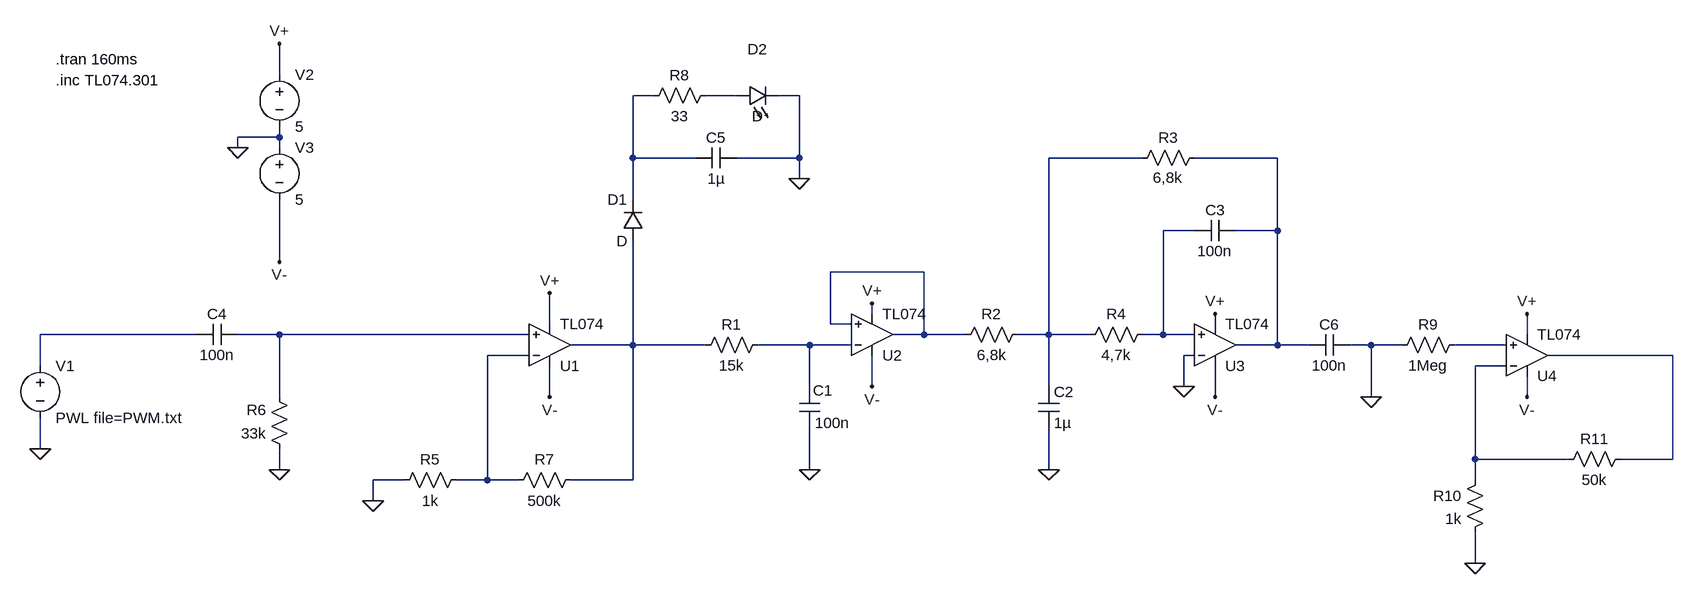
[diagram p0: schematic Empfangsseite_V2.asc]
Empfangsseite_V2.asc, the LTspice schematic file:
Version 4
SHEET 1 1944 680
WIRE -304 -336 -304 -384
WIRE 272 -304 240 -304
WIRE 400 -304 352 -304
WIRE 496 -304 464 -304
WIRE -304 -240 -304 -256
WIRE -304 -240 -368 -240
WIRE -368 -224 -368 -240
WIRE -304 -224 -304 -240
WIRE 240 -208 240 -304
WIRE 336 -208 240 -208
WIRE 496 -208 496 -304
WIRE 496 -208 400 -208
WIRE 1024 -208 880 -208
WIRE 1232 -208 1104 -208
WIRE 496 -176 496 -208
WIRE 240 -144 240 -208
WIRE 1104 -96 1056 -96
WIRE 1232 -96 1232 -208
WIRE 1232 -96 1168 -96
WIRE -304 -48 -304 -144
WIRE 688 -32 544 -32
WIRE 608 32 608 16
WIRE 112 48 112 0
WIRE 544 48 544 -32
WIRE 576 48 544 48
WIRE 1136 48 1136 32
WIRE -432 64 -672 64
WIRE -304 64 -368 64
WIRE 80 64 -304 64
WIRE 688 64 688 -32
WIRE 688 64 640 64
WIRE 752 64 688 64
WIRE 880 64 880 -208
WIRE 880 64 832 64
WIRE 944 64 880 64
WIRE 1056 64 1056 -96
WIRE 1056 64 1024 64
WIRE 1104 64 1056 64
WIRE 1616 64 1616 32
WIRE 240 80 240 -80
WIRE 240 80 144 80
WIRE 352 80 240 80
WIRE 512 80 432 80
WIRE 576 80 512 80
WIRE 1232 80 1232 -96
WIRE 1232 80 1168 80
WIRE 1280 80 1232 80
WIRE 1376 80 1344 80
WIRE 1424 80 1376 80
WIRE 1584 80 1504 80
WIRE 80 96 16 96
WIRE 1104 96 1088 96
WIRE 1840 96 1648 96
WIRE -672 112 -672 64
WIRE 1584 112 1536 112
WIRE 512 144 512 80
WIRE 608 144 608 96
WIRE 880 144 880 64
WIRE 1088 144 1088 96
WIRE -304 160 -304 64
WIRE 112 160 112 112
WIRE 1136 160 1136 112
WIRE 1376 160 1376 80
WIRE 1616 160 1616 128
WIRE -672 240 -672 192
WIRE 1536 256 1536 112
WIRE 1680 256 1536 256
WIRE 1840 256 1840 96
WIRE 1840 256 1760 256
WIRE -304 272 -304 240
WIRE 512 272 512 208
WIRE 880 272 880 208
WIRE -112 288 -160 288
WIRE 16 288 16 96
WIRE 16 288 -32 288
WIRE 64 288 16 288
WIRE 240 288 240 80
WIRE 240 288 144 288
WIRE 1536 288 1536 256
WIRE -160 320 -160 288
WIRE 1536 416 1536 368
FLAG 512 272 0
FLAG 880 272 0
FLAG 1088 144 0
FLAG -672 240 0
FLAG -304 -384 V+
FLAG 608 16 V+
FLAG 1136 32 V+
FLAG 1136 160 V-
FLAG 608 144 V-
FLAG -304 -48 V-
FLAG -368 -224 0
FLAG 112 0 V+
FLAG 112 160 V-
FLAG -304 272 0
FLAG -160 320 0
FLAG 496 -176 0
FLAG 1376 160 0
FLAG 1616 32 V+
FLAG 1616 160 V-
FLAG 1536 416 0
SYMBOL cap 496 144 R0
WINDOW 0 21 6 Left 2
SYMATTR InstName C1
SYMATTR Value 100n
SYMBOL cap 864 144 R0
SYMATTR InstName C2
SYMATTR Value 1µ
SYMBOL cap 1168 -112 R90
WINDOW 0 0 32 VBottom 2
WINDOW 3 32 32 VTop 2
SYMATTR InstName C3
SYMATTR Value 100n
SYMBOL res 448 64 R90
WINDOW 0 0 56 VBottom 2
WINDOW 3 32 56 VTop 2
SYMATTR InstName R1
SYMATTR Value 15k
SYMBOL res 848 48 R90
WINDOW 0 0 56 VBottom 2
WINDOW 3 32 56 VTop 2
SYMATTR InstName R2
SYMATTR Value 6,8k
SYMBOL res 1120 -224 R90
WINDOW 0 0 56 VBottom 2
WINDOW 3 31 57 VTop 2
SYMATTR InstName R3
SYMATTR Value 6,8k
SYMBOL res 1040 48 R90
WINDOW 0 0 56 VBottom 2
WINDOW 3 32 56 VTop 2
SYMATTR InstName R4
SYMATTR Value 4,7k
SYMBOL voltage -672 96 R0
WINDOW 123 24 124 Left 2
WINDOW 39 0 0 Left 2
SYMATTR InstName V1
SYMATTR Value PWL file=PWM.txt
SYMBOL voltage -304 -352 R0
WINDOW 123 0 0 Left 2
WINDOW 39 0 0 Left 2
SYMATTR InstName V2
SYMATTR Value 5
SYMBOL voltage -304 -240 R0
WINDOW 123 0 0 Left 2
WINDOW 39 0 0 Left 2
SYMATTR InstName V3
SYMATTR Value 5
SYMBOL res -288 256 R180
WINDOW 0 36 76 Left 2
WINDOW 3 36 40 Left 2
SYMATTR InstName R6
SYMATTR Value 33k
SYMBOL cap -368 48 R90
WINDOW 0 0 32 VBottom 2
WINDOW 3 32 32 VTop 2
SYMATTR InstName C4
SYMATTR Value 100n
SYMBOL res -16 272 R90
WINDOW 0 0 56 VBottom 2
WINDOW 3 32 56 VTop 2
SYMATTR InstName R5
SYMATTR Value 1k
SYMBOL res 160 272 R90
WINDOW 0 0 56 VBottom 2
WINDOW 3 32 56 VTop 2
SYMATTR InstName R7
SYMATTR Value 500k
SYMBOL diode 256 -80 R180
WINDOW 0 24 64 Left 2
WINDOW 3 24 0 Left 2
SYMATTR InstName D1
SYMBOL LED 400 -288 R270
WINDOW 0 72 32 VTop 2
WINDOW 3 0 32 VBottom 2
SYMATTR InstName D2
SYMBOL res 368 -320 R90
WINDOW 0 0 56 VBottom 2
WINDOW 3 32 56 VTop 2
SYMATTR InstName R8
SYMATTR Value 33
SYMBOL cap 400 -224 R90
WINDOW 0 0 32 VBottom 2
WINDOW 3 32 32 VTop 2
SYMATTR InstName C5
SYMATTR Value 1µ
SYMBOL cap 1344 64 R90
WINDOW 0 0 32 VBottom 2
WINDOW 3 32 32 VTop 2
SYMATTR InstName C6
SYMATTR Value 100n
SYMBOL res 1520 64 R90
WINDOW 0 0 56 VBottom 2
WINDOW 3 32 56 VTop 2
SYMATTR InstName R9
SYMATTR Value 1Meg
SYMBOL res 1552 272 M0
SYMATTR InstName R10
SYMATTR Value 1k
SYMBOL res 1664 272 R270
WINDOW 0 32 56 VTop 2
WINDOW 3 0 56 VBottom 2
SYMATTR InstName R11
SYMATTR Value 50k
SYMBOL Opamps\\opamp2 112 144 M180
SYMATTR InstName U1
SYMATTR Value TL074
SYMBOL Opamps\\opamp2 608 128 M180
SYMATTR InstName U2
SYMATTR Value TL074
SYMBOL Opamps\\opamp2 1136 144 M180
SYMATTR InstName U3
SYMATTR Value TL074
SYMBOL Opamps\\opamp2 1616 160 M180
SYMATTR InstName U4
SYMATTR Value TL074
TEXT -648 -360 Left 2 !.tran 160ms
TEXT -648 -328 Left 2 !.inc TL074.301

The netlist it stands for:
* Empfangsseite_V2.asc
C1 N010 0 100n
C2 N003 0 1µ
C3 N004 N005 100n
R1 N010 N009 15k
R2 N003 N006 6,8k
R3 N004 N003 6,8k
R4 N005 N003 4,7k
V1 N007 0 PWL file=PWM.txt
V2 V+ 0 5
V3 0 V- 5
R6 0 N008 33k
C4 N008 N007 100n
R5 N012 0 1k
R7 N009 N012 500k
D1 N009 N001 D
D2 N002 0 D
R8 N002 N001 33
C5 0 N001 1µ
C6 0 N004 100n
R9 N011 0 1Meg
R10 N014 0 1k
R11 N014 N013 50k
XU1 N008 N012 V- V+ N009 TL074  ; pins In+ In- V+ V- OUT
XU2 N006 N010 V- V+ N006 TL074  ; pins In+ In- V+ V- OUT
XU3 N005 0 V- V+ N004 TL074  ; pins In+ In- V+ V- OUT
XU4 N011 N014 V- V+ N013 TL074  ; pins In+ In- V+ V- OUT
.model D D
.lib standard.dio
.tran 160ms
.inc TL074.301
.backanno
.end